# Altium schematic sheet Motor Drivers.SchDoc: Title
size A4; Date: *******; ApprovedBy: *******; CheckedBy: Yasiru Banayake; Author: *******; CompanyName: *******; DrawnBy: Name; Engineer: *******; Organization: *******; Address1: *******; Address2: *******; Address3: *******; Address4: *******; DocumentNumber: Doc Num; Revision: *******; SheetNumber: 5; SheetTotal: 11; Subtitle: Motor Drivers JST; Project: Resturant Robot; VersionRevision: III; TotalSheet: 11; CurrentTime: *******; CurrentDate: *******; Time: *******; DocumentFullPathAndName: *******; DocumentName: *******; ModifiedDate: *******; ImagePath: *******; ProjectName: *******; Application_BuildNumber: *******
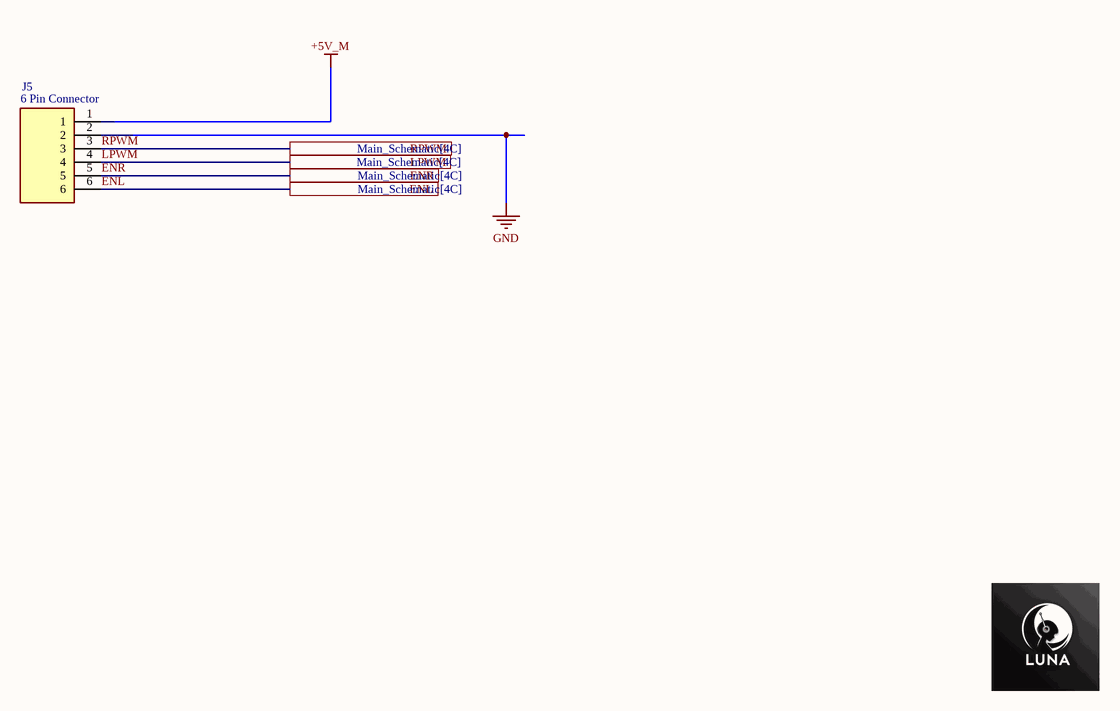
[diagram p0: Motor Drivers.SchDoc]

## Parts
J5  6 Pin Connector  [SHDR6W64P0X250_1X6_1740X575X700P]

## Ports
ENL (see Main_Schematic[4C]), ENR (see Main_Schematic[4C]), LPWM (see Main_Schematic[4C]), RPWM (see Main_Schematic[4C])

## Nets
+5V_M: J5.1
GND: J5.2
ENL: J5.6 ; port ENL
ENR: J5.5 ; port ENR
LPWM: J5.4 ; port LPWM
RPWM: J5.3 ; port RPWM

## Notes on the sheet
- Title:
- Drawn By:
- Page Contents:
- Checked By:
- Subtitle:
- University Of Moratuwa
- Moratuwa
- Size:
- Date:
- File:
- Email:
- A4
- lasithnawanjaan123@gmail.com
- Lasith Haputhanthri
- Number:
- Time:
- Revision:
- Sheet
- of
- Katubedda
- 10500
- Sri Lanka

## Library data of the parts
J5 = B6B-XH-A_LF__SN_: B6B-XH-A_LF__SN_ Connector; Manufacturer_Name: JST (JAPAN SOLDERLESS TERMINALS); Manufacturer_Part_Number: B6B-XH-A(LF)(SN); Datasheet Link: https://datasheet.lcsc.com/szlcsc/JST-Sales-America-B6B-XH-A-LF-SN_C144397.pdf; Height: 7mm; Arrow Part Number: B6B-XH-A(LF)(SN); Arrow Price/Stock: https://www.arrow.com/en/products/b6b-xh-a-lf-sn/jst-manufacturing?region=europe